# Altium schematic sheet P10_EX-Headers.SchDoc
size 301 x 239 mm
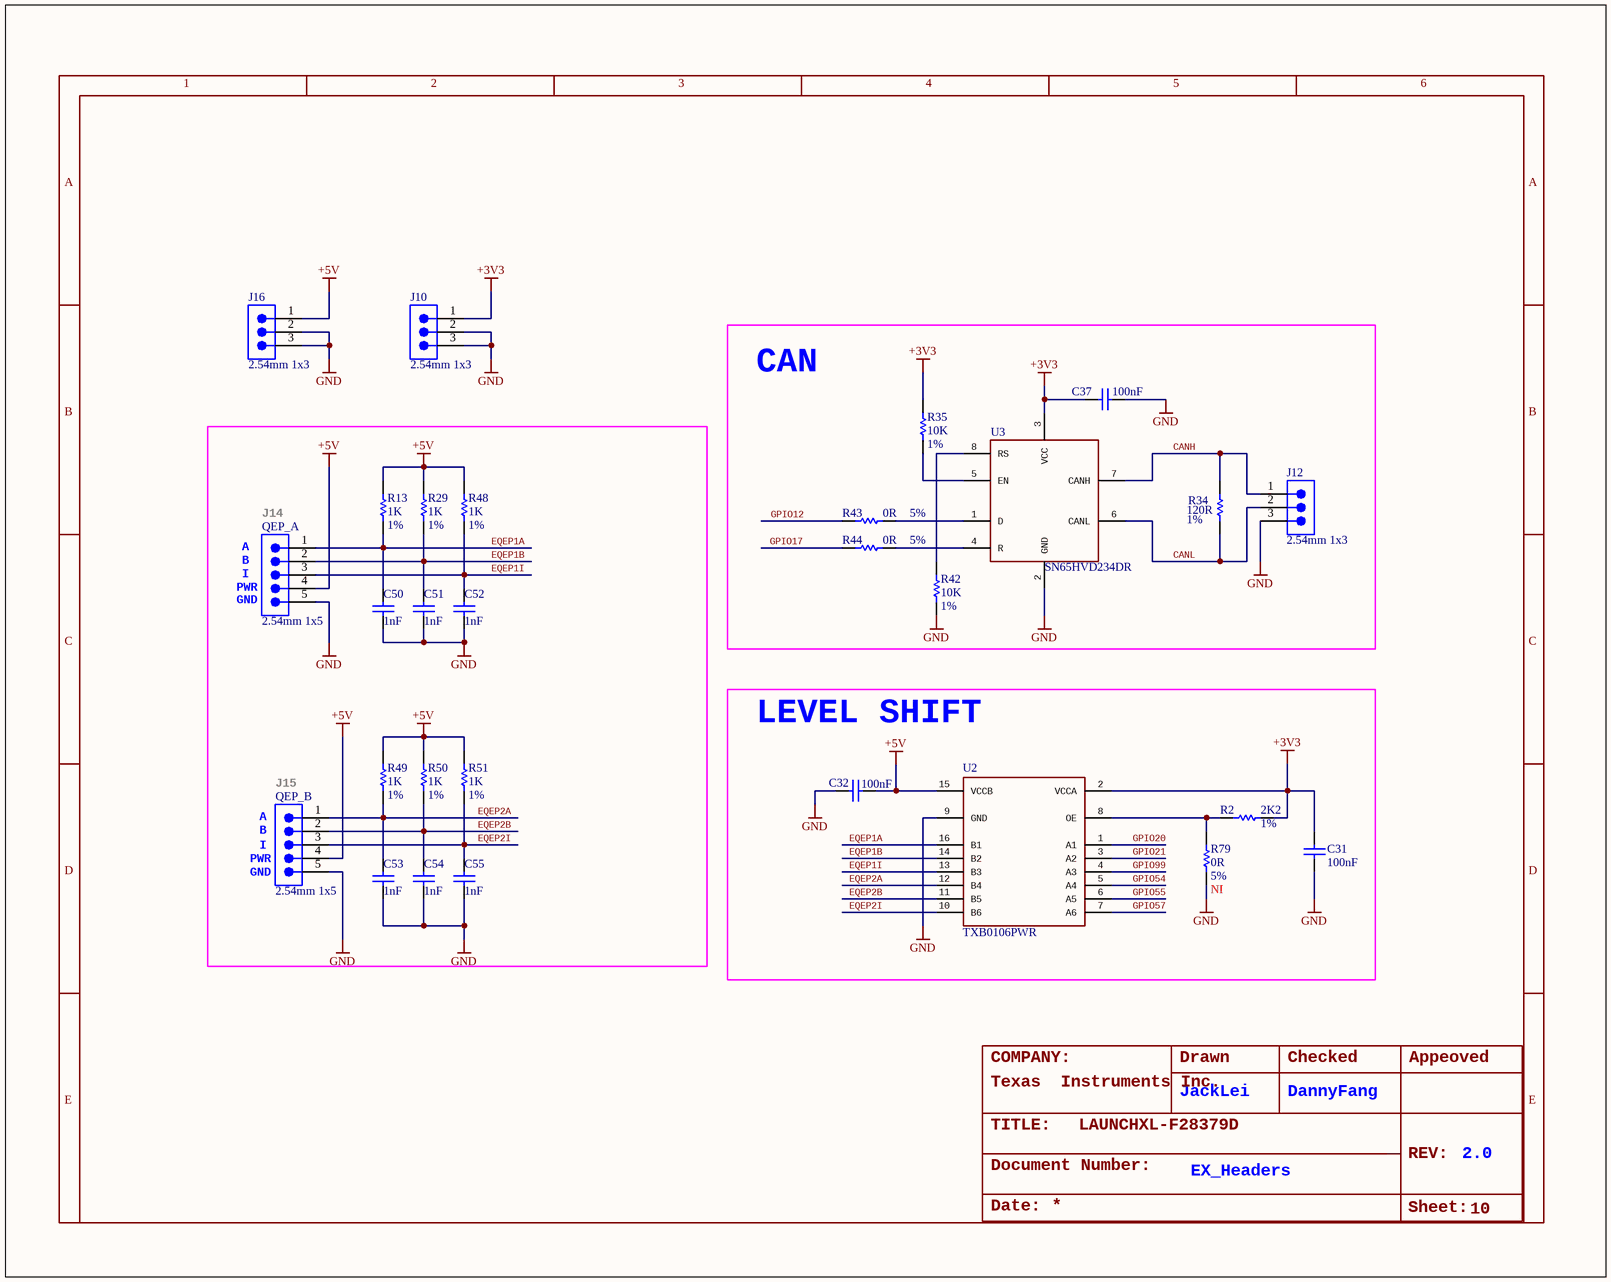
[diagram p0: P10_EX-Headers.SchDoc]

## Parts
C31  100nF  [C0402]
C32  100nF  [C0402]
C37  100nF  [C0402]
C50  1nF  [C0402]
C51  1nF  [C0402]
C52  1nF  [C0402]
C53  1nF  [C0402]
C54  1nF  [C0402]
C55  1nF  [C0402]
J10  value 2.54mm 1x3  [HDRV3W64P254_1X3_762X250X850P]  (hidden comment: P6E03A-602530-B1)
J12  value 2.54mm 1x3  [HDRV3W64P254_1X3_762X250X850P]  (hidden comment: P6E03A-602530-B1)
J16  value 2.54mm 1x3  [HDRV3W64P254_1X3_762X250X850P]  (hidden comment: P6E03A-602530-B1)
QEP_A  value 2.54mm 1x5  [HDRV5W64P254_1X5_1270X250X850P]  (hidden comment: P101-1*05SGF-116A-NX)
QEP_B  value 2.54mm 1x5  [HDRV5W64P254_1X5_1270X250X850P]  (hidden comment: P101-1*05SGF-116A-NX)
R2  Rating: 1%  [R0402]  (hidden comment: 2K2)
R13  Rating: 1%  [R0402]  (hidden comment: 1K)
R29  Rating: 1%  [R0402]  (hidden comment: 1K)
R34  Rating: 1%  [R0603]  (hidden comment: 120R)
R35  Rating: 1%  [R0402]  (hidden comment: 10K)
R42  Rating: 1%  [R0402]  (hidden comment: 10K)
R43  Rating: 5%  [R0402]  (hidden comment: 0R)
R44  Rating: 5%  [R0402]  (hidden comment: 0R)
R48  Rating: 1%  [R0402]  (hidden comment: 1K)
R49  Rating: 1%  [R0402]  (hidden comment: 1K)
R50  Rating: 1%  [R0402]  (hidden comment: 1K)
R51  Rating: 1%  [R0402]  (hidden comment: 1K)
R79  Rating: 5%  ASSY: NI  [R0603]  (hidden comment: 0R)
U2  TXB0106PWR  [TSSOP65P640X120-16N]
U3  SN65HVD234DR  [SOIC127P600X175-8N]

## Blocks framed on the sheet
CAN: C37 J12 R34 R35 R42-R44 U3
LEVEL SHIFT: C31 C32 R2 R79 U2

## Nets
+3V3: C31.1 C37.2 J10.1 R2.1 R35.2 U2.2(VCCA) U3.3(VCC)
+5V: C32.2 J16.1 QEP_A.4 QEP_B.4 R13.1 R29.1 R48.1 R49.1 R50.1 R51.1 U2.15(VCCB)
GND: C31.2 C32.1 C37.1 C50.1 C51.1 C52.1 C53.1 C54.1 C55.1 J10.2 J10.3 J12.3 J16.2 J16.3 QEP_A.5 QEP_B.5 R42.2 R79.2 U2.9(GND) U3.2(GND)
CANH: J12.1 R34.2 U3.7(CANH)
CANL: J12.2 R34.1 U3.6(CANL)
EQEP1A: C50.2 QEP_A.1 R13.2 U2.16(B1)
EQEP1B: C51.2 QEP_A.2 R29.2 U2.14(B2)
EQEP1I: C52.2 QEP_A.3 R48.2 U2.13(B3)
EQEP2A: C53.2 QEP_B.1 R49.2 U2.12(B4)
EQEP2B: C54.2 QEP_B.2 R50.2 U2.11(B5)
EQEP2I: C55.2 QEP_B.3 R51.2 U2.10(B6)
GPIO12: R43.2
GPIO17: R44.2
GPIO20: U2.1(A1)
GPIO21: U2.3(A2)
GPIO54: U2.5(A4)
GPIO55: U2.6(A5)
GPIO57: U2.7(A6)
GPIO99: U2.4(A3)
NetR2_2: R2.2 R79.1 U2.8(OE)
NetR35_1: R35.1 U3.5(EN)
NetR42_1: R42.1 U3.8(RS)
NetR43_1: R43.1 U3.1(D)
NetR44_1: R44.1 U3.4(R)

## Notes on the sheet
- (near QEP_A) A
- (near QEP_A) J14
- (near QEP_A) GND
- (near QEP_A) PWR
- (near QEP_A) B
- (near QEP_A) I
- (near QEP_B) A
- (near QEP_B) J15
- (near QEP_B) GND
- (near QEP_B) PWR
- (near QEP_B) B
- (near QEP_B) I
- COMPANY:
- Texas
  Instruments Inc.
- JackLei
- Drawn
- Checked
- DannyFang
- Appeoved
- TITLE:
- Document Number:
- LAUNCHXL-F28379D
- REV:
- 2.0
- Date:
- EX_Headers
- Sheet:
- 10
- 1
- 2
- 3
- 4
- 5
- 6
- C
- D
- E

## Library data of the parts
C31 C32 C37 = 1004001100187: CAP,100NF(0.1uf),+/-10%,X5R,10V,SMD0402; Manufacturer: MURATA; Manufacturer Part Number: GRM155R61A104KA01D; Rating: 10%; Embest PN: 1004001100187; Value: 100nF; Part Type: Ceramic Capacitor
C50-C55 = 1004001100030: CAP,1NF,+/-10%,X7R,50V,SMD0402; Manufacturer: MURATA; Manufacturer Part Number: GRM155R71H102KA01D; Rating: 10%; Embest PN: 1004001100030; Value: 1nF; Part Type: Ceramic Capacitor
J10 J12 J16 = 1009001200009: Connector,Pin Header,Straight,Male,1x3Pin,2.54MM pitch,6.00,3.00,Gold Flash 1u, black,DIP,alt_code:15071706; Manufacturer: CHIN-BAN; Embest PN: 1009001200009; Part Type: Pin Header; Manufacturer Part Number: P6E03A-602530-B1
QEP_A QEP_B = 1009001200016: Connector,Pin Header,Straight,Male,1x5Pin,2.54MM pitch,6.06,3.00,Gold Flash 1u, black,DIP; Manufacturer: TOWNES; Embest PN: 1009001200016; Part Type: Pin Header; Manufacturer Part Number: P101-1*05SGF-116A-NX
R2 = 1003001100045: RES,2K2,+/-1%,1/16W,SMD0402; Manufacturer: YAGEO; Manufacturer Part Number: RC0402FR-072K2L; Embest PN: 1003001100045; Value: 2K2; Part Type: Thick film Resistor
R13 R29 R48-R51 = 1003001100034: RES,1K,+/-1%,1/16W,SMD0402; Manufacturer: YAGEO; Manufacturer Part Number: RC0402FR-071KL; Embest PN: 1003001100034; Value: 1K; Part Type: Thick film Resistor
R34 = 1003001100187: RES,120R,+/-1%,1/10W,SMD0603; Manufacturer: YAGEO; Manufacturer Part Number: RC0603FR-07120RL; Embest PN: 1003001100187; Value: 120R; Part Type: Thick film Resistor
R35 R42 = 1003001100071: RES,10K,+/-1%,1/16W,SMD0402; Manufacturer: YAGEO; Manufacturer Part Number: RC0402FR-0710KL; Embest PN: 1003001100071; Value: 10K; Part Type: Thick film Resistor
R43 R44 = 1003001100001: RES,0R,+/-5%,1/16W,SMD0402; Manufacturer: YAGEO; Manufacturer Part Number: RC0402JR-070RL; Embest PN: 1003001100001; Value: 0R; Part Type: Thick film Resistor
R79 = 1003001100161: RES,0R,+/-5%,1/10W,SMD0603; Manufacturer: YAGEO; Manufacturer Part Number: RC0603JR-070RL; Embest PN: 1003001100161; Value: 0R; Part Type: Thick film Resistor
U2 = 1002008100038C: IC, 6-BIT BIDIRECTIONAL VOLTAGE-LEVEL TRANSLATOR WITH AUTO-DIRECTION SENSING AND ±15-kV ESD PROTECTION, TXB0106PWR, TSSOP-16, SMD,Cusomer Supply; Manufacturer: TI; Embest PN: 1002008100038C; Value: TXB0106PWR; Part Type: Logic; Manufacturer Part Number: TXB0106PWR
U3 = 1002010100117C: IC CAN TRANSCEIVER 3.3V 8-SOIC; Manufacturer: TI; Embest PN: 1002010100117C; Value: SN65HVD234DR; Part Type: Interface; Manufacturer Part Number: SN65HVD234DR